# Altium project HDC1080.PrjPCB
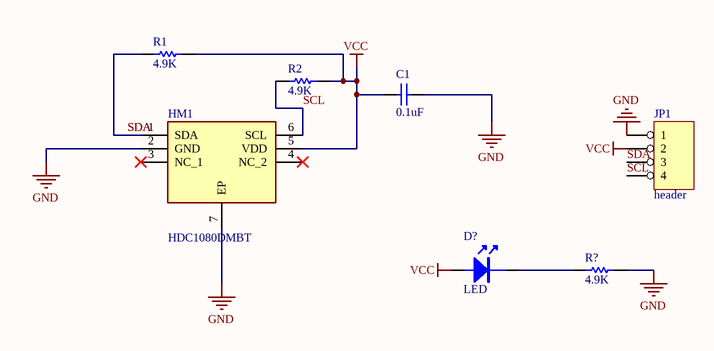
[diagram p0: Sheet1.SchDoc]
1 sheet, 7 parts. Net scope: global (net labels, ports and power ports of the same name join across sheets).
Board file: PCB1.PcbDoc

## Sheet Sheet1.SchDoc
size A4

### Parts
C1  0.1uF  [0603_C]
D?  LED  [0805LED]
HM1  HDC1080DMBT  [SON100P300X300X80-7N]
JP1  header  [header4]
R1  4.9K  [R0603]
R2  4.9K  [R0603]
R?  4.9K  [R0603]

### Nets
GND: C1.2 HM1.2(GND) HM1.7(EP) JP1.1 R?.2
VCC: C1.1 D?.1 HM1.5(VDD) JP1.2 R1.2 R2.2
SCL: HM1.6(SCL) JP1.4 R2.1
SDA: HM1.1(SDA) JP1.3 R1.1
NetD?_2: D?.2 R?.1

Not connected (* = marked no-connect by the designer): HM1 3(NC_1)* 4(NC_2)*

### Library data of the parts
C1 = CAP: Capacitor; Value: 104; Published: 8-Jun-2000; LatestRevisionDate: 17-Jul-2002; LatestRevisionNote: Re-released for DXP Platform.; PackageReference: RAD-0.3; Publisher: Altium Limited
D? = LED: LED 发光二极管
HM1 = HDC1080DMBT: Hygrometer; Manufacturer_Name: Texas Instruments; Datasheet Link: http://www.mouser.com/ds/2/405/hdc1080-844688.pdf; Height: 0.8mm; Manufacturer_Part_Number: HDC1080DMBT; Mouser Part Number: 595-HDC1080DMBT; Mouser Price/Stock: https://www.mouser.com/Search/Refine.aspx?Keyword=595-HDC1080DMBT; RS Part Number: 1684955; RS Price/Stock: https://uk.rs-online.com/web/p/products/1684955
JP1 = HEADER 4
R1 R2 R? = RES: Resistor; Value: 1K; Published: 8-Jun-2000; Revision: July-2002: Re-released for DXP Platform.; Publisher: Altium Limited